# Altium project UAC_PCB.PrjPcb
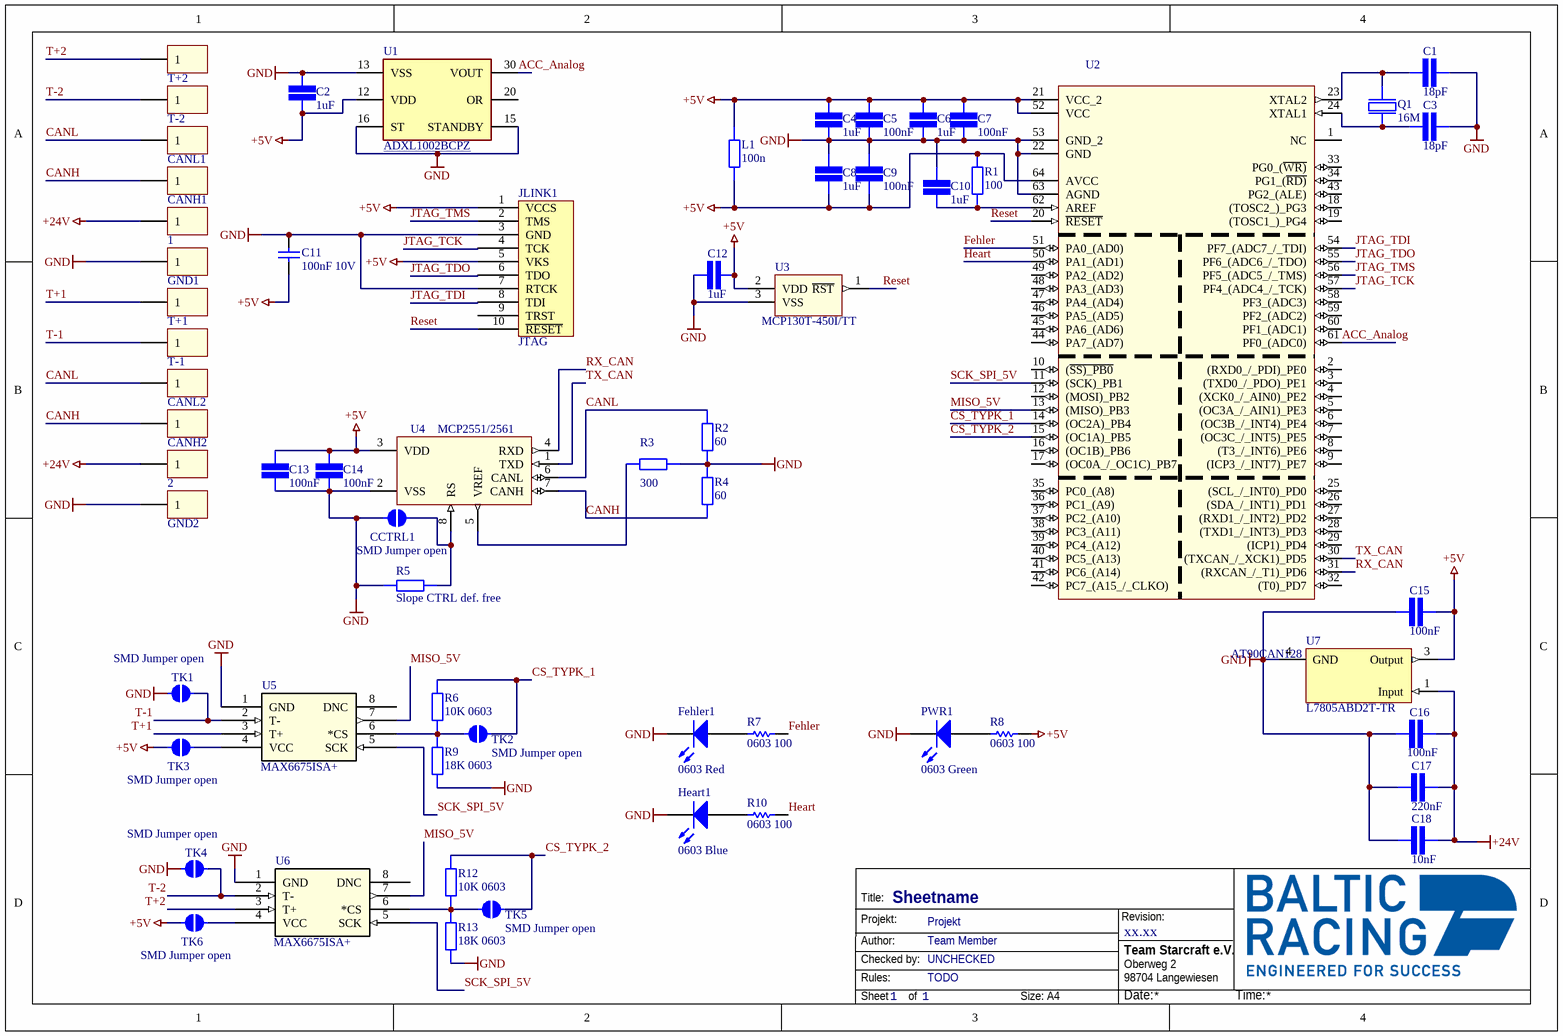
[diagram p0: main-UAC.SchDoc]
1 sheet, 62 parts. Net scope: global (net labels, ports and power ports of the same name join across sheets).
Board file: UAC.PcbDoc

## Sheet main-UAC.SchDoc: Sheetname
size A4; Date: 05.10.2017; CheckedBy: UNCHECKED; Author: Team Member; Organization: Team Starcraft e.V.; Address1: Oberweg 2; Address2: 98704 Langewiesen; Revision: xx.xx; SheetNumber: 1; SheetTotal: 1; Rules: TODO; ProjectName: Projekt

### Parts
1  61300111121  [61300111121]  (value not drawn)
2  61300111121  [61300111121]  (value not drawn)
C1  value 18pF  [CAP 0603/1608]  (hidden comment: SMD Capacitor)
C2  value 1uF  [CAP 0603/1608]  (hidden comment: SMD Capacitor)
C3  value 18pF  [CAP 0603/1608]  (hidden comment: SMD Capacitor)
C4  value 1uF  [CAP 0603/1608]  (hidden comment: SMD Capacitor)
C5  value 100nF  [CAP 0603/1608]  (hidden comment: SMD Capacitor)
C6  value 1uF  [CAP 0603/1608]  (hidden comment: SMD Capacitor)
C7  value 100nF  [CAP 0603/1608]  (hidden comment: SMD Capacitor)
C8  value 1uF  [CAP 0603/1608]  (hidden comment: SMD Capacitor)
C9  value 100nF  [CAP 0603/1608]  (hidden comment: SMD Capacitor)
C10  value 1uF  [CAP 0603/1608]  (hidden comment: SMD Capacitor)
C11  100nF 10V  [CAPC0603(1608)100_L]
C12  value 1uF  [CAP 0603/1608]  (hidden comment: SMD Capacitor)
C13  value 100nF  [CAP 0603/1608]  (hidden comment: SMD Capacitor)
C14  value 100nF  [CAP 0603/1608]  (hidden comment: SMD Capacitor)
C15  value 100nF  [CAP 0603/1608]  (hidden comment: SMD Capacitor)
C16  value 100nF  [CAP 0603/1608]  (hidden comment: SMD Capacitor)
C17  value 220nF  [CAP 0603/1608]  (hidden comment: SMD Capacitor)
C18  value 10nF  [CAP 0603/1608]  (hidden comment: SMD Capacitor)
CANH1  61300111121  [61300111121]  (value not drawn)
CANH2  61300111121  [61300111121]  (value not drawn)
CANL1  61300111121  [61300111121]  (value not drawn)
CANL2  61300111121  [61300111121]  (value not drawn)
CCTRL1  SMD Jumper open  [SMD-JUMPER-OPEN]  (no BOM)
Fehler1  0603 Red  [0603_A]
GND1  61300111121  [61300111121]  (value not drawn)
GND2  61300111121  [61300111121]  (value not drawn)
Heart1  0603 Blue  [0603_A]
JLINK1  JTAG  [SEGGER_10_PIN]  (no BOM)
L1  value 100n  [STACKPOLE CSR0603]  (hidden comment: SMD Resistor)
PWR1  0603 Green  [0603_A]
Q1  16M  [NDK NX5032GA]
R1  value 100  [STACKPOLE CSR0603]  (hidden comment: SMD Resistor)
R2  value 60  [STACKPOLE CSR0603]  (hidden comment: SMD Resistor)
R3  value 300  [STACKPOLE CSR0603]  (hidden comment: SMD Resistor, optional)
R4  value 60  [STACKPOLE CSR0603]  (hidden comment: SMD Resistor)
R5  value Slope CTRL def. free  [STACKPOLE CSR0603]  (hidden comment: SMD Resistor)
R6  value 10K 0603  [STACKPOLE CSR0603]  (hidden comment: SMD Resistor)
R7  0603 100  [RESC1608X55X25ML10T15]
R8  0603 100  [RESC1608X55X25ML10T15]
R9  value 18K 0603  [STACKPOLE CSR0603]  (hidden comment: SMD Resistor)
R10  0603 100  [RESC1608X55X25ML10T15]
R12  value 10K 0603  [STACKPOLE CSR0603]  (hidden comment: SMD Resistor)
R13  value 18K 0603  [STACKPOLE CSR0603]  (hidden comment: SMD Resistor)
T+1  61300111121  [61300111121]  (value not drawn)
T+2  61300111121  [61300111121]  (value not drawn)
T-1  61300111121  [61300111121]  (value not drawn)
T-2  61300111121  [61300111121]  (value not drawn)
TK1  SMD Jumper open  [SMD-JUMPER-OPEN]  (no BOM)
TK2  SMD Jumper open  [SMD-JUMPER-OPEN]  (no BOM)
TK3  SMD Jumper open  [SMD-JUMPER-OPEN]  (no BOM)
TK4  SMD Jumper open  [SMD-JUMPER-OPEN]  (no BOM)
TK5  SMD Jumper open  [SMD-JUMPER-OPEN]  (no BOM)
TK6  SMD Jumper open  [SMD-JUMPER-OPEN]  (no BOM)
U1  ADXL1002BCPZ  [Analog_Devices_CP-32-26_IPC_A]
U2  AT90CAN128  [AT90CAN128-16MU]
U3  MCP130T-450I/TT  [*SOT95P237X112-3N]
U4  MCP2551/2561  [*SOIC127P600X175-8N]
U5  MAX6675ISA+  [SOIC8]
U6  MAX6675ISA+  [SOIC8]
U7  L7805ABD2T-TR  [DPAK254P1542X460-3M]

### Nets
+5V: C2.1 C4.2 C5.2 C6.2 C7.2 C8.1 C9.1 C11.1 C12.1 C13.2 C14.2 C15.1 JLINK1.1(VCCS) JLINK1.5(VKS) L1.1 L1.2 R1.2 R8.1 TK3.1 TK6.1 U1.12(VDD) U2.21(VCC_2) U2.52(VCC) U2.64(AVCC) U3.2(VDD) U4.3(VDD) U7.3(Output)
+24V: 1.1 2.1 C16.1 C17.1 C18.1 U7.1(Input)
GND: C1.1 C2.2 C3.1 C4.1 C5.1 C6.1 C7.1 C8.2 C9.2 C10.2 C11.2 C12.2 C13.1 C14.1 C15.2 C16.2 C17.2 C18.2 CCTRL1.1 Fehler1.1(K) GND1.1 GND2.1 Heart1.1(K) JLINK1.3(GND) JLINK1.7(RTCK) PWR1.1(K) R2.2 R3.2 R4.1 R5.1 R9.1 R13.1 TK1.1 TK4.1 U1.13(VSS) U1.15(STANDBY) U1.16(ST) U2.22(GND) U2.53(GND_2) U2.63(AGND) U3.3(VSS) U4.2(VSS) U5.1(GND) U6.1(GND) U7.4(GND)
ACC_Analog: U1.30(VOUT) U2.61(PF0_(ADC0))
CANH: CANH1.1 CANH2.1 R4.2 U4.7(CANH)
CANL: CANL1.1 CANL2.1 R2.1 U4.6(CANL)
CS_TYPK_1: R6.2 TK2.2 U2.14((OC2A)_PB4)
CS_TYPK_2: R12.2 TK5.2 U2.15((OC1A)_PB5)
Fehler: R7.1 U2.51(PA0_(AD0))
Heart: R10.1 U2.50(PA1_(AD1))
JTAG_TCK: JLINK1.4(TCK) U2.57(PF4_(ADC4_/_TCK))
JTAG_TDI: JLINK1.8(TDI) U2.54(PF7_(ADC7_/_TDI))
JTAG_TDO: JLINK1.6(TDO) U2.55(PF6_(ADC6_/_TDO))
JTAG_TMS: JLINK1.2(TMS) U2.56(PF5_(ADC5_/_TMS))
MISO_5V: U2.13((MISO)_PB3) U5.7(SO) U6.7(SO)
Reset: JLINK1.10(~{RESET}) U2.20(~{RESET}) U3.1(~{RST})
RX_CAN: U2.31((RXCAN_/_T1)_PD6) U4.4(RXD)
SCK_SPI_5V: U2.11((SCK)_PB1) U5.5(SCK) U6.5(SCK)
T+1: T+1.1 U5.3(T+)
T+2: T+2.1 U6.3(T+)
T-1: T-1.1 TK1.2 U5.2(T-)
T-2: T-2.1 TK4.2 U6.2(T-)
TX_CAN: U2.30((TXCAN_/_XCK1)_PD5) U4.1(TXD)
NetC1_2: C1.2 Q1.2 U2.23(XTAL2)
NetC3_2: C3.2 Q1.1 U2.24(XTAL1)
NetC10_1: C10.1 R1.1 U2.62(AREF)
NetCCTRL1_2: CCTRL1.2 R5.2 U4.8(RS)
NetFehler1_2: Fehler1.2(A) R7.2
NetHeart1_2: Heart1.2(A) R10.2
NetPWR1_2: PWR1.2(A) R8.2
NetR3_1: R3.1 U4.5(VREF)
NetR6_1: R6.1 R9.2 TK2.1 U5.6(*CS)
NetR12_1: R12.1 R13.2 TK5.1 U6.6(*CS)
NetTK3_2: TK3.2 U5.4(VCC)
NetTK6_2: TK6.2 U6.4(VCC)

Not connected (* = marked no-connect by the designer): JLINK1 9(TRST); U1 1(NIC) 2(NIC) 3(NIC) 4(NIC) 5(NIC) 6(NIC) 7(NIC) 8(NIC) 9(NIC) 10(DNC) 11(DNC) 14(VSS) 17(DNC) 18(DNC) 19(DNC) 20(OR) 21(DNC) 22(DNC) 23(DNC) 24(DNC) 25(DNC) 26(DNC) 27(VSS) 28(VSS) 29(DNC) 31(NIC) 32(NIC) 33(EPAD); U2 1(NC) 2((RXD0_/_PDI)_PE0) 3((TXD0_/_PDO)_PE1) 4((XCK0_/_AIN0)_PE2) 5((OC3A_/_AIN1)_PE3) 6((OC3B_/_INT4)_PE4) 7((OC3C_/_INT5)_PE5) 8((T3_/_INT6)_PE6) 9((ICP3_/_INT7)_PE7) 10((~{SS)_PB0}) 12((MOSI)_PB2) 16((OC1B)_PB6) 17((OC0A_/_OC1C)_PB7) 18((TOSC2_)_PG3) 19((TOSC1_)_PG4) 25((SCL_/_INT0)_PD0) 26((SDA_/_INT1)_PD1) 27((RXD1_/_INT2)_PD2) 28((TXD1_/_INT3)_PD3) 29((ICP1)_PD4) 32((T0)_PD7) 33(PG0_(~{WR)}) 34(PG1_(~{RD)}) 35(PC0_(A8)) 36(PC1_(A9)) 37(PC2_(A10)) 38(PC3_(A11)) 39(PC4_(A12)) 40(PC5_(A13)) 41(PC6_(A14)) 42(PC7_(A15_/_CLKO)) 43(PG2_(ALE)) 44(PA7_(AD7)) 45(PA6_(AD6)) 46(PA5_(AD5)) 47(PA4_(AD4)) 48(PA3_(AD3)) 49(PA2_(AD2)) 58(PF3_(ADC3)) 59(PF2_(ADC2)) 60(PF1_(ADC1)); U5 8(DNC); U6 8(DNC)

### Notes on the sheet
- Title:
- Projekt:
- Revision:
- Author:
- Rules:
- Checked by:
- Sheet
- of
- Size:
- A4
- Date:
- Time:

### Library data of the parts
1 2 CANH1 CANH2 CANL1 CANL2 GND1 GND2 T+1 T+2 T-1 T-2 = 61300111121: WR-PHD 2.54 mm THT Pin Header, 1p; Pin Number: 1; Rated Current: 3 A; Working Voltage: 250 VAC; Withstanding Voltage: 500 VAC; Pitch: 2.54 mm; ComponentLink1Description: Manufacturer; ComponentLink1URL: http://www.we-online.de; ComponentLink2Description: Datasheet; ComponentLink2URL: http://katalog.we-online.de/em/datasheet/6130xx11121.pdf; Part Number: 61300111121; Published Date: Aug 2017; Publisher: Wurth Elektronik
C1-C10 C12-C18 = SMD Capacitor: Capacitor with multiple Footprints
C11 = CMP-1035-02579-1: CAP 100nF 10V ±5% 0603 (1608 Metric) Thickness 1mm SMD; Tolerance: Â±5%; Case-EIA: 0603; Case-Metric: 1608; Value: 100nF; Max Thickness: 1 mm; Rated Voltage: 10 V; Technology: SMT
Fehler1 Heart1 PWR1 = CMP-1426-00002-1: SMD mono-color Chip LED, WL-SMCW, Green; PartNumber: 150060GS75000; Manufacturer: Wuerth Elektronik; ComponentLink1URL: http://www.we-online.com; ComponentLink2Description: Datasheet; Color: Green; ComponentLink2URL: http://katalog.we-online.com/led/datasheet/150060GS75000.pdf; PackageReference: 0603_A; ComponentLink1Description: Manufacturer URL
JLINK1 = Segger 10-Pin
L1 = SMD Resistor: Spule
Q1 = 16 MHz Quartz
R1-R6 R9 R12 R13 = SMD Resistor: Resistor with multiple footprints
R7 R8 R10 = CMP-2100-03663-1: Chip Resistor, 100 Ohm, +/- 1%, 0.1 W, -55 to 155 degC, 0603 (1608 Metric), RoHS, Tape and Reel; Manufacturer: Yageo; Voltage Rating (DC): 50V; Power Rating: 100mW; Resistance: 100Ohm; Temperature Coefficient: 100ppm/degreesC; Number of Pins: 2; Tolerance: 1%; Height: 0.45mm; Manufacturer URL: http://www.yageo.com/; Military Standard: Not; Datasheet URL: http://www.yageo.com/NewPortal/yageodocoutput?fileName=/pdf/R-Chip/PYu-RC_Group_51_RoHS_L_5.pdf; Case Code (Imperial): 0603; Termination: SMD/SMT; Lead Free: LeadFree; Max Operating Temperature: 155degC; Case Code (Metric): 1608; RoHSCompliant: true; Voltage Rating: 50V; Width: 0.8mm; Composition: ThickFilm; Depth: 0.8mm; REACH SVHC: Unknown; Min Operating Temperature: -55degC; Packaging: TapeandReel; Package Description: 2-Pin Surface Mount Device, Body 1.6 x 0.8 mm; Length: 1.6mm; Package Reference: 0603; Datasheet Version: Rev. 5, 10/2016; Case/Package: 0603
U2 = AT90CAN128: Ic Mcu 8bit 128kb Flash 64tqfp; MP: AT90CAN128-16AI; MF: Microchip; Package: TQFP-64 Microchip; SnapEDA_Link: https://www.snapeda.com/parts/AT90CAN128-16AI/Microchip/view-part/?ref=snap; Price: None; Availability: Unavailable; Value: *
U3 = MCP130T-450I/TT: System Supervisors - Power Supply Monitors with Reset Generators Open Drain Low; MF: Microchip; MP: MCP120T-450I/TT; Price: None; SnapEDA_Link: https://www.snapeda.com/parts/MCP120T-450I/TT/Microchip/view-part/?ref=snap; Package: SOT-23-3 Microchip; Availability: Unavailable; Value: *
U4 = MCP2551-I/SN: MCP2551 Series 5.5 V 1 Mb/s Surface Mount High-Speed CAN Transceiver - SOIC-8; MF: Microchip; MP: MCP2551-I/SN; SnapEDA_Link: https://www.snapeda.com/parts/MCP2551-I/SN/Microchip/view-part/?ref=snap; Price: None; Package: SOIC-8 Microchip; Availability: Unavailable; Value: *
U5 U6 = MAX31855KASA+: Sensor-Schnittstelle Cold-Junction-Compensated K-Thermocouple-to-Digital Converter (0 C to +1024 C); Vendor: Maxim Integrated Products; Built_By: EMA_UL_Team; Manufacturer_Part_Number: MAX31855KASA+; Copyright: Copyright (C) 2018 Accelerated Designs. All rights reserved; RefDes: RefDes; Type: DEV; Value: Value; ComponentLink1Description: Mouser Link; ComponentLink1URL: https://www.mouser.de/ProductDetail/Maxim-Integrated/MAX6675ISA%2b?qs=sGAEpiMZZMvC4tFtz7F%252BjlDa83CXkCzyzlU%2FLj4OjiI%3D; ComponentLink2Description: Datasheet; ComponentLink2URL: https://4donline.ihs.com/images/VipMasterIC/IC/MAXM/MAXMS02453/MAXMS02453-1.pdf?hkey=52A5661711E402568146F3353EA87419
U7 = L7805ABD2T-TR: Linear Voltage Regulators 5.0V 1.5A Positive
U1 = ADXL1002BCPZ: ComponentLink1Description: New link; ComponentLink1URL: https://octopart.com/adxl1002bcpz-analog+devices-81920647?r=sp